# Altium schematic sheet ZynqPL_GTXE2.SchDoc
size A4; Author: Carlos Barreiro; Organization: Escuela Técnica Superior de Ingeniería de Sistemas Informáticos de la Universidad Politécnica de Madrid; Address1: Campus Sur de la Universidad Politécnica de Madrid; Address2: Calle de Alan Turing, s/nº; Address3: Madrid 28031; Address4: España; DocumentNumber: 9; SheetNumber: 9; SheetTotal: 16
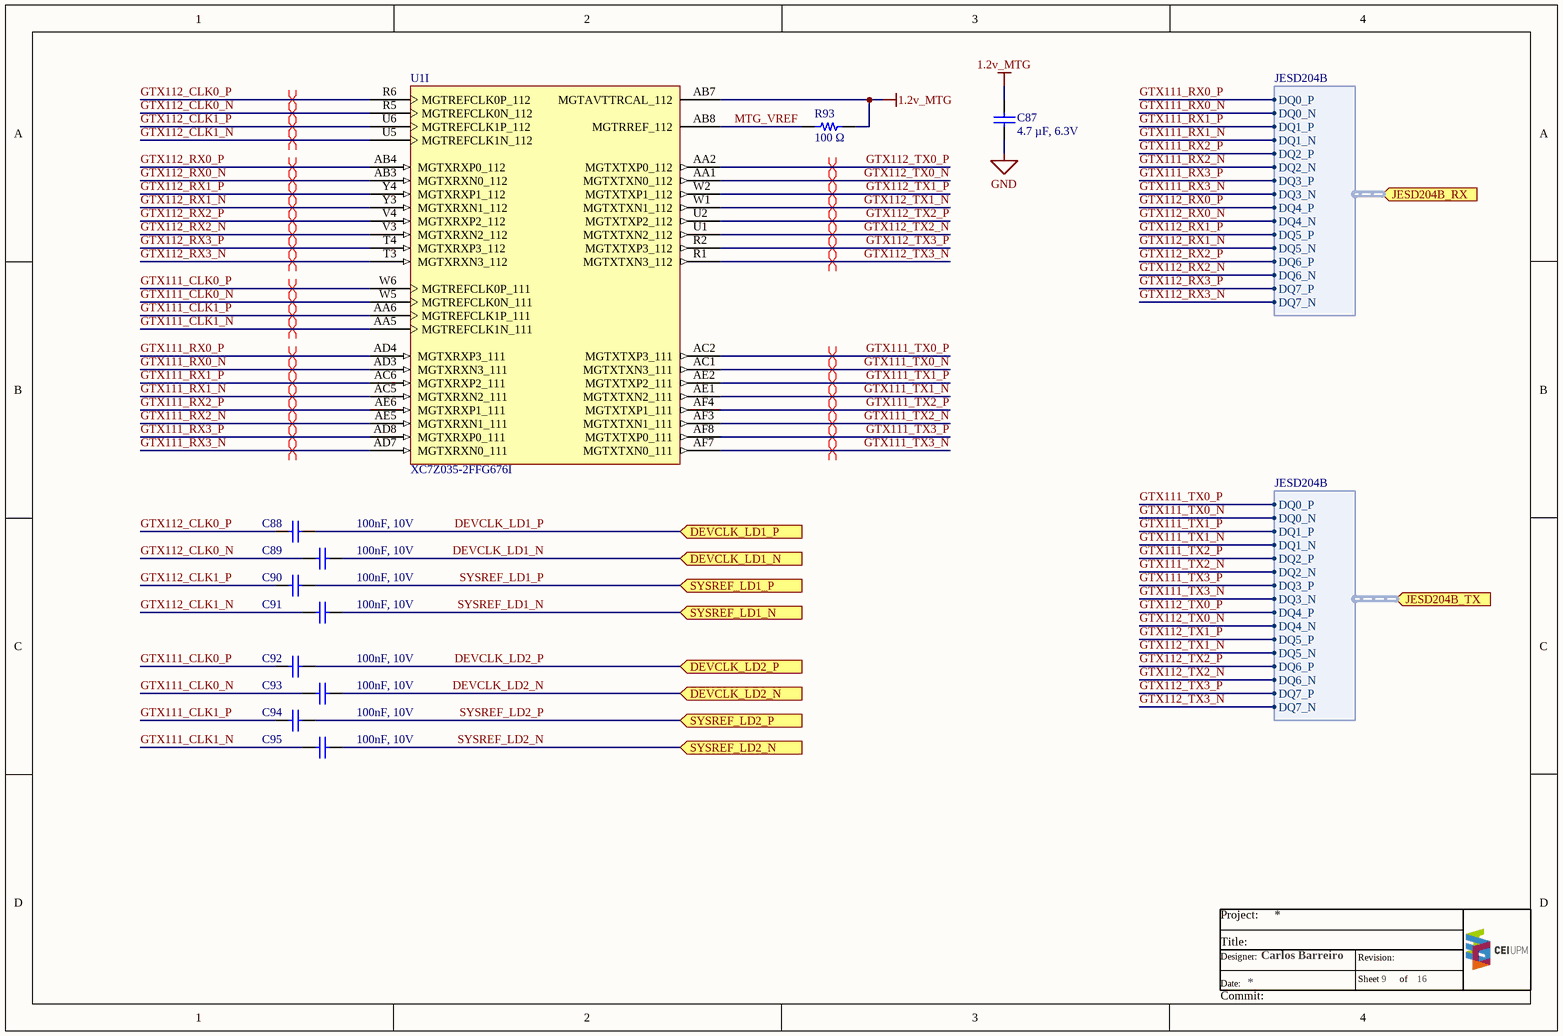
[diagram p0: ZynqPL_GTXE2.SchDoc]

## Parts
C87  4.7 µF, 6.3V  [WURTH_WCAP-CSGP_0402]
C88  100nF, 10V  [WURTH_WCAP-CSGP_0402]
C89  100nF, 10V  [WURTH_WCAP-CSGP_0402]
C90  100nF, 10V  [WURTH_WCAP-CSGP_0402]
C91  100nF, 10V  [WURTH_WCAP-CSGP_0402]
C92  100nF, 10V  [WURTH_WCAP-CSGP_0402]
C93  100nF, 10V  [WURTH_WCAP-CSGP_0402]
C94  100nF, 10V  [WURTH_WCAP-CSGP_0402]
C95  100nF, 10V  [WURTH_WCAP-CSGP_0402]
R93  100 Ω  [PANASONIC_ERJ2G_0402]
U1  XC7Z035-2FFG676I  [XILINX_FBG676]  (part I of 13)

## Ports
DEVCLK_LD1_N (in), DEVCLK_LD1_P (in), DEVCLK_LD2_N (in), DEVCLK_LD2_P (in), JESD204B_RX (in, harness JESD204B), JESD204B_TX (in, harness JESD204B), SYSREF_LD1_N (in), SYSREF_LD1_P (in), SYSREF_LD2_N (in), SYSREF_LD2_P (in)

## Harnesses
JESD204B: DQ0_P, DQ0_N, DQ1_P, DQ1_N, DQ2_P, DQ2_N, DQ3_P, DQ3_N, DQ4_P, DQ4_N, DQ5_P, DQ5_N, DQ6_P, DQ6_N, DQ7_P, DQ7_N

## Nets
1.2v_MTG: C87.2 R93.2 U1.AB7(MGTAVTTRCAL_112)
GND: C87.1
DEVCLK_LD1_N: C89.2 ; port DEVCLK_LD1_N
DEVCLK_LD1_P: C88.2 ; port DEVCLK_LD1_P
DEVCLK_LD2_N: C93.2 ; port DEVCLK_LD2_N
DEVCLK_LD2_P: C92.2 ; port DEVCLK_LD2_P
GTX111_CLK0_N: C93.1 U1.W5(MGTREFCLK0N_111)
GTX111_CLK0_P: C92.1 U1.W6(MGTREFCLK0P_111)
GTX111_CLK1_N: C95.1 U1.AA5(MGTREFCLK1N_111)
GTX111_CLK1_P: C94.1 U1.AA6(MGTREFCLK1P_111)
GTX111_RX0_N: U1.AD3(MGTXRXN3_111) ; port JESD204B_RX.DQ0_N
GTX111_RX0_P: U1.AD4(MGTXRXP3_111) ; port JESD204B_RX.DQ0_P
GTX111_RX1_N: U1.AC5(MGTXRXN2_111) ; port JESD204B_RX.DQ1_N
GTX111_RX1_P: U1.AC6(MGTXRXP2_111) ; port JESD204B_RX.DQ1_P
GTX111_RX2_N: U1.AE5(MGTXRXN1_111) ; port JESD204B_RX.DQ2_N
GTX111_RX2_P: U1.AE6(MGTXRXP1_111) ; port JESD204B_RX.DQ2_P
GTX111_RX3_N: U1.AD7(MGTXRXN0_111) ; port JESD204B_RX.DQ3_N
GTX111_RX3_P: U1.AD8(MGTXRXP0_111) ; port JESD204B_RX.DQ3_P
GTX111_TX0_N: U1.AC1(MGTXTXN3_111) ; port JESD204B_TX.DQ0_N
GTX111_TX0_P: U1.AC2(MGTXTXP3_111) ; port JESD204B_TX.DQ0_P
GTX111_TX1_N: U1.AE1(MGTXTXN2_111) ; port JESD204B_TX.DQ1_N
GTX111_TX1_P: U1.AE2(MGTXTXP2_111) ; port JESD204B_TX.DQ1_P
GTX111_TX2_N: U1.AF3(MGTXTXN1_111) ; port JESD204B_TX.DQ2_N
GTX111_TX2_P: U1.AF4(MGTXTXP1_111) ; port JESD204B_TX.DQ2_P
GTX111_TX3_N: U1.AF7(MGTXTXN0_111) ; port JESD204B_TX.DQ3_N
GTX111_TX3_P: U1.AF8(MGTXTXP0_111) ; port JESD204B_TX.DQ3_P
GTX112_CLK0_N: C89.1 U1.R5(MGTREFCLK0N_112)
GTX112_CLK0_P: C88.1 U1.R6(MGTREFCLK0P_112)
GTX112_CLK1_N: C91.1 U1.U5(MGTREFCLK1N_112)
GTX112_CLK1_P: C90.1 U1.U6(MGTREFCLK1P_112)
GTX112_RX0_N: U1.AB3(MGTXRXN0_112) ; port JESD204B_RX.DQ4_N
GTX112_RX0_P: U1.AB4(MGTXRXP0_112) ; port JESD204B_RX.DQ4_P
GTX112_RX1_N: U1.Y3(MGTXRXN1_112) ; port JESD204B_RX.DQ5_N
GTX112_RX1_P: U1.Y4(MGTXRXP1_112) ; port JESD204B_RX.DQ5_P
GTX112_RX2_N: U1.V3(MGTXRXN2_112) ; port JESD204B_RX.DQ6_N
GTX112_RX2_P: U1.V4(MGTXRXP2_112) ; port JESD204B_RX.DQ6_P
GTX112_RX3_N: U1.T3(MGTXRXN3_112) ; port JESD204B_RX.DQ7_N
GTX112_RX3_P: U1.T4(MGTXRXP3_112) ; port JESD204B_RX.DQ7_P
GTX112_TX0_N: U1.AA1(MGTXTXN0_112) ; port JESD204B_TX.DQ4_N
GTX112_TX0_P: U1.AA2(MGTXTXP0_112) ; port JESD204B_TX.DQ4_P
GTX112_TX1_N: U1.W1(MGTXTXN1_112) ; port JESD204B_TX.DQ5_N
GTX112_TX1_P: U1.W2(MGTXTXP1_112) ; port JESD204B_TX.DQ5_P
GTX112_TX2_N: U1.U1(MGTXTXN2_112) ; port JESD204B_TX.DQ6_N
GTX112_TX2_P: U1.U2(MGTXTXP2_112) ; port JESD204B_TX.DQ6_P
GTX112_TX3_N: U1.R1(MGTXTXN3_112) ; port JESD204B_TX.DQ7_N
GTX112_TX3_P: U1.R2(MGTXTXP3_112) ; port JESD204B_TX.DQ7_P
MTG_VREF: R93.1 U1.AB8(MGTRREF_112)
SYSREF_LD1_N: C91.2 ; port SYSREF_LD1_N
SYSREF_LD1_P: C90.2 ; port SYSREF_LD1_P
SYSREF_LD2_N: C95.2 ; port SYSREF_LD2_N
SYSREF_LD2_P: C94.2 ; port SYSREF_LD2_P

## Layout directives
differential pair: GTX111_CLK0_N, GTX111_CLK0_P, GTX111_CLK1_N, GTX111_CLK1_P, GTX111_RX0_N, GTX111_RX0_P, GTX111_RX1_N, GTX111_RX1_P, GTX111_RX2_N, GTX111_RX2_P, GTX111_RX3_N, GTX111_RX3_P, GTX111_TX0_N, GTX111_TX0_P, GTX111_TX1_N, GTX111_TX1_P, GTX111_TX2_N, GTX111_TX2_P, GTX111_TX3_N, GTX111_TX3_P, GTX112_CLK0_N, GTX112_CLK0_P, GTX112_CLK1_N, GTX112_CLK1_P, GTX112_RX0_N, GTX112_RX0_P, GTX112_RX1_N, GTX112_RX1_P, GTX112_RX2_N, GTX112_RX2_P, GTX112_RX3_N, GTX112_RX3_P, GTX112_TX0_N, GTX112_TX0_P, GTX112_TX1_N, GTX112_TX1_P, GTX112_TX2_N, GTX112_TX2_P, GTX112_TX3_N, GTX112_TX3_P

## Notes on the sheet
- Project:
- Title:
- Date:
- Designer:
- Sheet
- Revision:
- of
- Commit:

## Library data of the parts
C87 = GRM155C80J475MEAAD: Multilayer Ceramic Capacitors MLCC, size 0402, X5R, 4.7 µF, 6.3V; Manufacturer: Murata; Rated Voltage: 6.3VDC; Ceramic Type: X6S; Capacitance Tolerance: +/-20%; Dissipation Factor max.: 10%; Capacitance: 4.7 µF; Operating Temperature: -55 to +105degC; Packaging: Tape and Reel; Manufacturer Part Number: GRM155C80J475MEAAD; Height: 0.5mm; Mounting Technology: SMT; Size: 0402; Supplier 1: Digi-Key; Supplier 2: Mouser; Supplier Part Number 1: 490-14458-1-ND; Supplier Part Number 2: 81-GRM155C80J475MEAD
C88-C95 = 885012205018: WCAP-CSGP Multilayer Ceramic Chip Capacitor, General Purpose, size 0402, X7R, 100nF, 10V; Manufacturer: Wurth Elektronik; Rated Voltage: 10VDC; Isolation Resistance  min.: 5GOhm; Capacitance Tolerance: +/-10%; Dissipation Factor max.: 5%; Technical Reference: X7R0402104K010DFCT10000; ComponentLink1Description: Manufacturer; ComponentLink1URL: http://www.we-online.de; ComponentLink2Description: Datasheet; ComponentLink2URL: https://www.we-online.com/catalog/datasheet/885012205018.pdf; Operating Temperature: -55 to +125degC; Packaging: Tape and Reel; Manufacturer Part Number: 885012205018; Published Date: April 2021; Ceramic Type: X7R; Height: 0.5mm; Mounting Technology: SMT; Size: 0402; Capacitance: 100nF; Q-Factor min.: -
R93 = ERJ2GEJ101X: General Purpose Thick Film Chip Resistors; Manufacturer: Panasonic; Power (0402): 0.1 W; Limiting Voltage (0402): 50; Maximum Voltage (0402): 100; Resistance Range (Ω): 1Ω to 100MΩ; AEC 200: Grade 0; Size (0402): 2GE; ComponentLink1Description: Catalog; ComponentLink1URL: https://industrial.panasonic.com/ww/products/pt/general-purpose-chip-resistors/models?op=search&model_status_current=1&page=0#model-list-search-results; Series: ERJ; Temperature Range (ºC): -55 to +155; Supplier 1: Digi-Key; Supplier 2: Mouser; Supplier Part Number 2: 667-ERJ-2GEJ101X; Supplier Part Number 1: P100JTR-ND
U1 = XC7Z035-2FFG676I: 667 MHz Zynq™-7000 AP SoC, 130 PS I/O, 254 FPGA I/O, 676-Ball BGA, Speed Grade 1, Commercial Grade, Pb-Free; PartNumber: XC7Z035-2FBG676I; LUTs: 171,900; Extensible Block RAM (# 36Kb Blocks): 17.6Mb (500); Speed Grade: -2; Flip Flops: 343,800; ComponentLink5Description: Packaging and Pinout; ComponentLink4Description: Package File; ComponentLink5URL: http://www.xilinx.com/support/documentation/user_guides/ug865-Zynq-7000-Pkg-Pinout.pdf; Generic Part Number: XC7Z035; ComponentLink1Description: Datasheet; ComponentLink2Description: Package Specification; ComponentLink3URL: http://www.xilinx.com/support/documentation/data_sheets/ds191-XC7Z030-XC7Z045-data-sheet.pdf; ComponentLink1URL: http://www.xilinx.com/support/documentation/data_sheets/ds190-Zynq-7000-Overview.pdf; ComponentLink6Description: PCB and Layout Guide; Package: FBG676; ComponentLink3Description: DC and AC Switching Characteristics; ComponentLink6URL: http://www.xilinx.com/support/documentation/user_guides/ug483_7Series_PCB.pdf; RoHS: Pb-Free; ComponentLink4URL: http://www.xilinx.com/support/packagefiles/z7packages/xc7z030fbg676pkg.txt; ComponentLink2URL: http://www.xilinx.com/support/documentation/user_guides/ug475_7Series_Pkg_Pinout.pdf; PackageDescription: Flip-Chip Lidless BGA, Body 27 x 27 mm, 1.0 mm Pitch; Supplier 1: Digi-Key; Supplier 2: Mouser; Supplier Part Number 1: XC7Z035-2FFG676I-ND; Supplier Part Number 2: 217-XC7Z035-2FFG676I